# EAGLE design source_eagle (EAGLE 9.6.2)
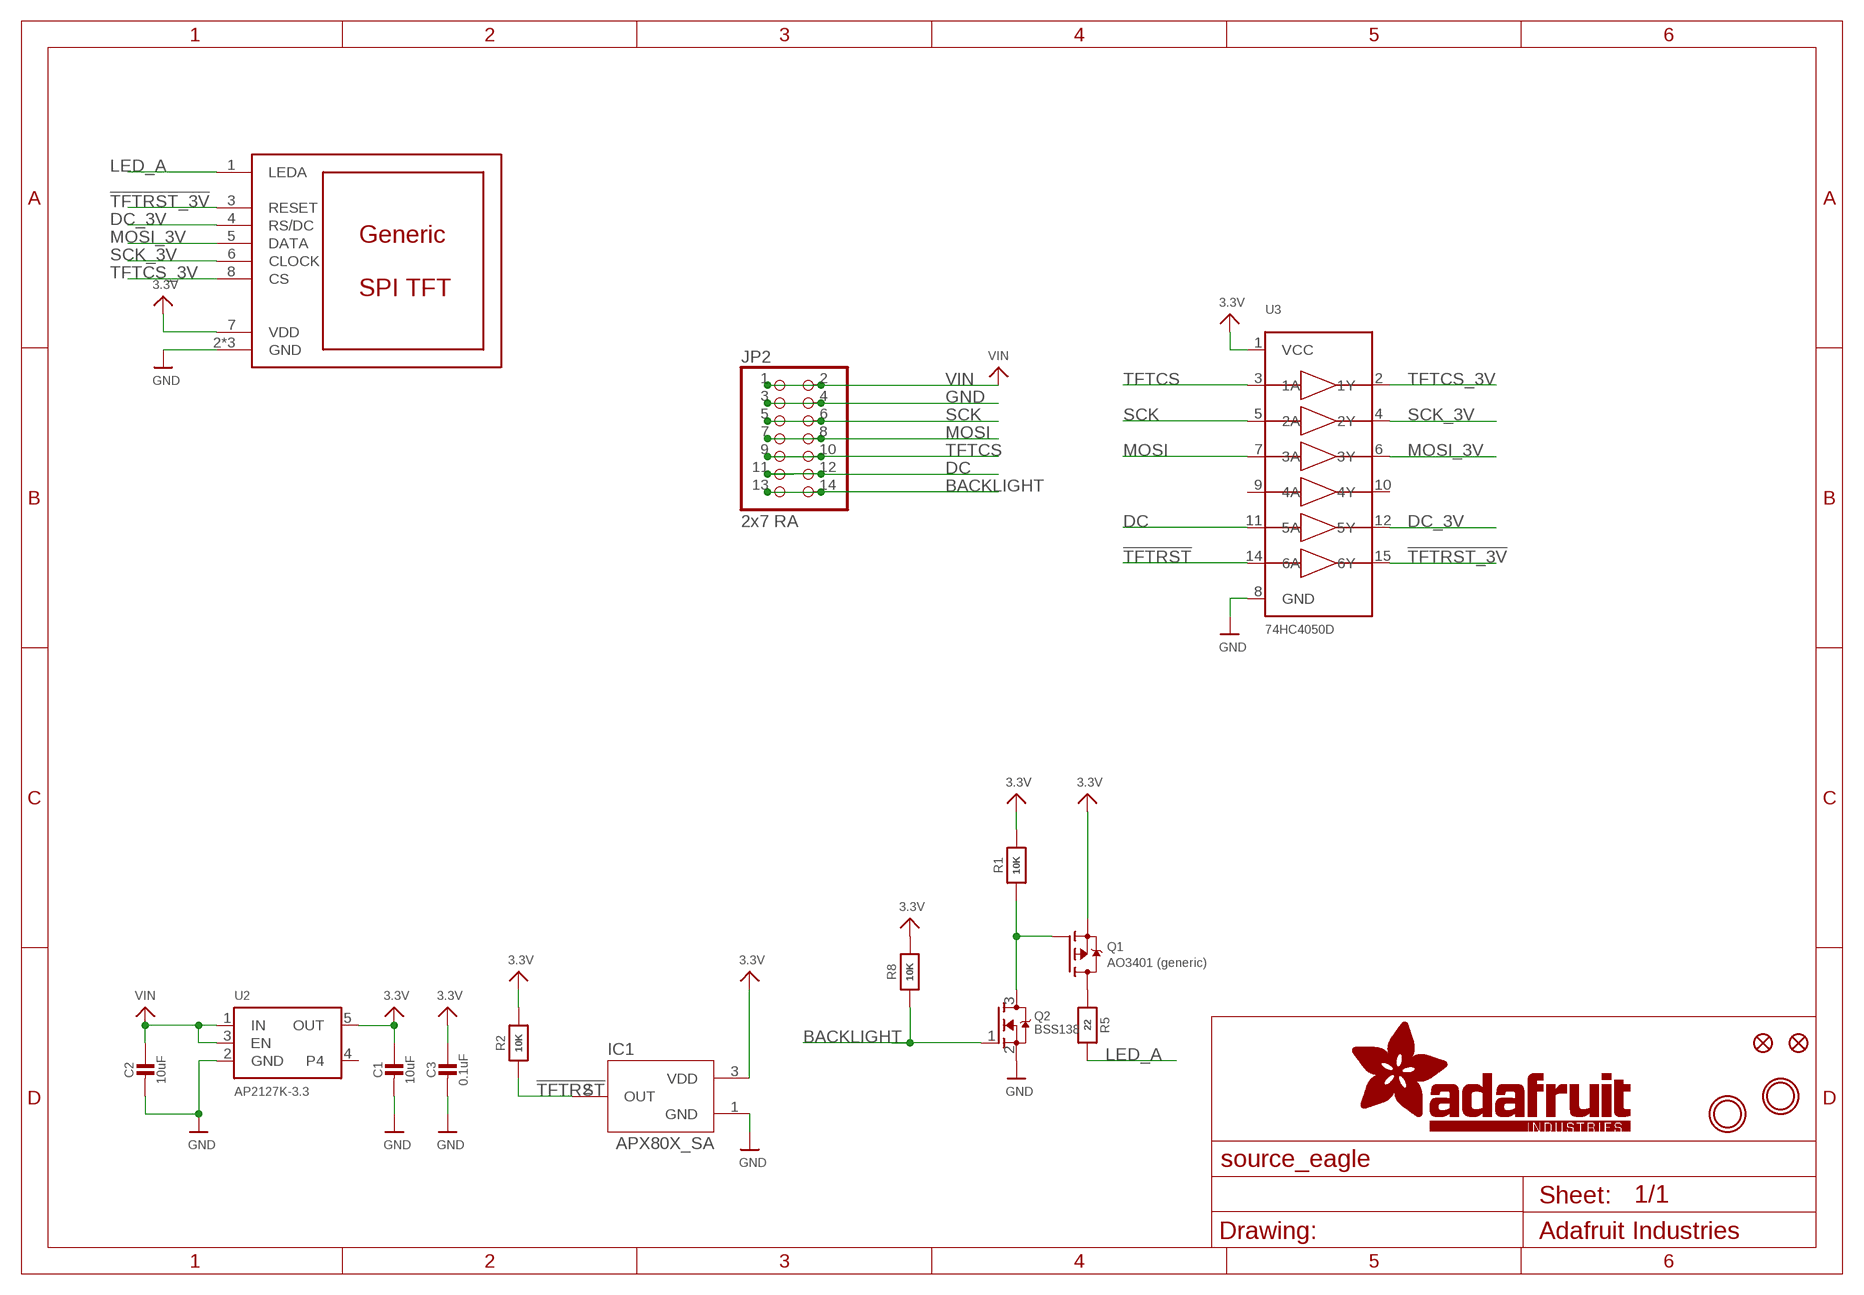
[diagram p0: schematic, sheet 1]

## Parts
C1  10uF  CAP_CERAMIC0805-NOOUTLINE  [0805-NO]
C2  10uF  CAP_CERAMIC0805-NOOUTLINE  [0805-NO]
C3  0.1uF  CAP_CERAMIC0603_NO  [0603-NO]
DISP2  DISP_LCD_GENERIC_SPI_NOLEDA_1.14_240X135_FPC  [TFT_1.14IN_240X135_FPC]
FID1  FIDUCIAL_1MM  [FIDUCIAL_1MM]
FID2  FIDUCIAL_1MM  [FIDUCIAL_1MM]
IC1  APX80X_SA  RESET_SUPERVISORAPX80X_SA  [SOT23-WIDE]
JP2  2x7 RA  HEADER-2X7_ROUND_70MIL  [2X07_ROUND_70MIL]
Q1  AO3401 (generic)  MOSFET-PWIDE  [SOT23-WIDE]
Q2  BSS138  MOSFET-NWIDE  [SOT23-WIDE]
R1  10K  RESISTOR_0603_NOOUT  [0603-NO]
R2  10K  RESISTOR_0603_NOOUT  [0603-NO]
R5  22  RESISTOR_0603_NOOUT  [0603-NO]
R8  10K  RESISTOR_0603_NOOUT  [0603-NO]
U2  AP2127K-3.3  VREG_SOT23-5  [SOT23-5]
U3  74HC4050D  74HC4050DTSSOP  [TSSOP16]
U$9  MOUNTINGHOLE2.5  [MOUNTINGHOLE_2.5_PLATED]
U$10  MOUNTINGHOLE2.5  [MOUNTINGHOLE_2.5_PLATED]

## Nets
3.3V: C1.1 C3.1 DISP2.7(VDD) IC1.3(VDD) Q1.2(S) R1.2 R2.2 R8.2 U2.5(OUT) U3.1(VCC)
!TFTRST: IC1.2(OUT) R2.1 U3.14(6A)
!TFTRST_3V: DISP2.3(RESET) U3.15(6Y)
BACKLIGHT: JP2.13 JP2.14 Q2.1(G) R8.1
DC: JP2.11 JP2.12 U3.11(5A)
DC_3V: DISP2.4(RS/DC) U3.12(5Y)
GND: C1.2 C2.2 C3.2 DISP2.2(GND) DISP2.MT1(GND) DISP2.MT2(GND) IC1.1(GND) JP2.3 JP2.4 Q2.2(S) U2.2(GND) U3.8(GND)
LED_A: DISP2.1(LEDA) R5.2
MOSI: JP2.7 JP2.8 U3.7(3A)
MOSI_3V: DISP2.5(DATA) U3.6(3Y)
N$1: Q1.3(D) R5.1
N$2: Q1.1(G) Q2.3(D) R1.1
SCK: JP2.5 JP2.6 U3.5(2A)
SCK_3V: DISP2.6(CLOCK) U3.4(2Y)
TFTCS: JP2.9 JP2.10 U3.3(1A)
TFTCS_3V: DISP2.8(CS) U3.2(1Y)
VIN: C2.1 JP2.1 JP2.2 U2.1(IN) U2.3(EN)
Unconnected: U2.4 U3.9(4A) U3.10(4Y)

## Library data of the parts
C1-C3 = microbuilder:CAP_CERAMIC: Ceramic Capacitors For new designs, use the packages preceded by an '_' character since they are more reliable: The following footprints should be used on most boards: _0402 - Standard footprint for regular board layouts _0603 - Standard footprint for regular board layouts _0805 - Standard footprint for regular board layouts _1206 - Standard footprint for regular board layouts For extremely tight-pitch boards where space is at a premium, the following 'micro-pitch' footprints can be used (smaller pads, no silkscreen outline, etc.): _0402MP - Micro-pitch footprint for very dense/compact boards _0603MP - Micro-pitch footprint for very dense/compact boards _0805MP - Micro-pitch footprint for very dense/compact boards _1206MP - Micro-pitch footprint for very dense/compact boards
DISP2 = adafruit_display:DISP_LCD_GENERIC_SPI_NOLEDA
FID1 FID2 = microbuilder:FIDUCIAL: Fiducial Alignment Points Various fiducial points for machine vision alignment.; BOM: EXCLUDE
IC1 = adafruit_power:RESET_SUPERVISOR; ROT: 270
JP2 = microbuilder:HEADER-2X7: PIN HEADER
Q1 = microbuilder:MOSFET-P: P-Channel Mosfet LEGEND VDS: Voltage Drain-Source ID: Drain Current RDS(ON): Drain-Source On-State Resistance VGS(TH): Gate-Source Threshold Voltage CISS: Drain-Source Input Capacitance SOT-23 Name VDS ID RDS(ON) VGS(TH) CISS Order Number IRLML5103 30V 760mA 600 mOhm -- 75pF @ 25V Digikey: IRLML5103PBFCT-ND IRLML6401 12V 4.3A 50 mOhm 950mV @ 250µA 830pF @ 10V Digikey: IRLML6401PBFTR-ND NTR0202PL 20V 400mA 800 mOhm 2.3V @ 250uA 70pF @ 5V Digikey: NTR0202PLT1GOSTR-ND NTR4101PT1G 20V 1.8A 85 mOhm 1.2V @ 250uA 675pF @ 10V Digikey: NTR4101PT1GOSCT-ND DMP2004K 20V 600mA 900 mOhm 1V @ 250uA 175pF @ 16V Digikey: DMP2004KDICT-ND PMV65XP 20V 3.9A 76 mOhm 950mV @ 1mA 725pF @ 20V Digikey: 568-2358-2-ND TO-252 Name VDS ID RDS(ON) VGS(TH) CISS Order Number AOD417 30V 25A 34 mOhm 3V @ 250µA 920pF @ 15V Digikey: 785-1106-2-ND PowerPak Name VDS ID RDS(ON) VGS(TH) CISS Order Number AON7401 30V 12A 14 mOhm 3V @ 250µA 2600pF @ 15V Digikey: 785-1302-1-ND
Q2 = microbuilder:MOSFET-N: N-Channel Mosfet LEGEND VDS: Voltage Drain-Source ID: Drain Current RDS(ON): Drain-Source On-State Resistance VGS(TH): Gate-Source Threshold Voltage CISS: Drain-Source Input Capacitance SOT-23 Name VDS ID RDS(ON) VGS(TH) CISS Order Number 2N7002E 60V 260mA 2.5 Ohm 2.5V @ 250uA 26.7pF @ 25V 2N7002ET1GOSTR-ND BSH103 30V 850mA 400 mOhm 400mV @ 1mA 83pF @ 24V BSH103,235-ND BSS138 60V 320mA 1.6 Ohm 1.5V @ 250uA 50pF @ 10V Mouser: 771-BSS138PW115 DMN2075U-7 20V 4.2A 38 mOhm 1V @ 250 uA 594.3pF @ 10V DMN2075U-7DICT-ND * BSS138 good choice for I2C level-shifting POWERPAK 1212-8 Name VDS ID RDS(ON) VGS(TH) CISS Order Number Si7308DN 60V 6A 58 mOhm 3V @ 250uA 665pF @ 15V SI7308DN-T1-E3CT-ND
R1 R2 R5 R8 = microbuilder:RESISTOR: Resistors For new designs, use the packages preceded by an '_' character since they are more reliable: The following footprints should be used on most boards: _0402 - Standard footprint for regular board layouts _0603 - Standard footprint for regular board layouts _0805 - Standard footprint for regular board layouts _1206 - Standard footprint for regular board layouts For extremely tight-pitch boards where space is at a premium, the following 'micro-pitch' footprints can be used (smaller pads, no silkscreen outline, etc.): _0402MP - Micro-pitch footprint for very dense/compact boards _0603MP - Micro-pitch footprint for very dense/compact boards _0805MP - Micro-pitch footprint for very dense/compact boards _1206MP - Micro-pitch footprint for very dense/compact boards
U2 = adafruit_power:VREG_SOT23-5: SOT23-5 Fixed Voltage Regulators Part Current Out V Out V In V Dropout θJA (°C/W) TJ (°C) Digikey Part No. ADP121 150mA 3.3V 3.4-5.5V 0.09V @ 150mA -- -- ADP121-AUJZ33R7CT-ND ADP121 150mA 3.0V 3.1-5.5V 0.09V @ 150mA -- -- ADP121-AUJZ30R7CT-ND ADP122 300mA 3.3V 3.4-5.5V 0.085V @ 300mA -- -- ADP122AUJZ-3.3-R7CT-ND ADP1712 300mA 3.3V 3.5-5.5V 0.17V @ 300mA -- -- ADP1712AUJZ-3.3-R7TR-ND AP7311 (Low Cost) 150mA 3.3V 3.5-6V 0.15V @ 150mA -- -- AP7311-33WG-7DICT-ND LD39015M18R 150mA 1.8V 1.9V-5.5V 0.08V @ 100mA -- -- 497-6977-1-ND LP2985A-33DBVR 150mA 3.3V 3.3-16V 0.28V @ 150mA 206 150 296-18479-1-ND MCP1824T-3302E/OT 300mA 3.3V 3.5V-6V 0.2V @ 300mA -- -- MCP1824T-3302E/OTCT-ND MIC5205-2.5YM5 TR 150mA 2.5V 2.7-16V 0.165V @ 150mA -- -- 576-1257-2-ND MIC5205-3.0YM5 TR 150mA 3.0V 3.2V-16V 0.165V @ 150mA -- -- 576-1258-2-ND MIC5205-3.3YM5 TR 150mA 3.3V 3.5V-16V 0.165V @ 150mA -- -- 576-1259-2-ND TPS780330220 150mA 3.3V+2.2V 3.6-5.5V 250mV Max -- -- 296-23332-1-ND TDA3663/N1,135 100mA 3.3V 3.5-45V 0.18V @ 50mA -- -- 568-5343-1-ND Max operating temp can be calculated using θJA, TJ (max junction temperature), and power in watts. Set the "Maximum Ambient Temperature" until it reaches TJ ("Max Junction Temperature"), which is the absolute limit for safe use of the regulator: Heat Sink Temperature Calculator <http://www.daycounter.com/Calculators/Heat-Sink-Temperature-Calculator.phtml> For example, With 12V source into a 3.3V LP2985 and a 30mA load, we are dissipating (12V-3.3V) * 0.03A = 0.261W. With a θJA of 206 °C/W, a TJ of 150°C, and 261mW we can safely use the chip without a heat sink up to 75°C (=147.1°C Junction Temperature).; JLC_ROTATION: 270
U3 = microbuilder:74HC4050D: 6-channel level shifter 74HC4050D - 2V-6V Supply SOIC16 Digikey: 74HC4050D,653-ND Mouser: 771-74HC4050D-T TSSOP16 Digikey: 296-9215-1-ND Mouser:
U$9 U$10 = adafruit_electromech:MOUNTINGHOLE: Mounting Hole For #2 screws (0.086"/2.18mm width, 0.094"/2.4mm hole) use 2.5mm; BOM: EXCLUDE

## Board
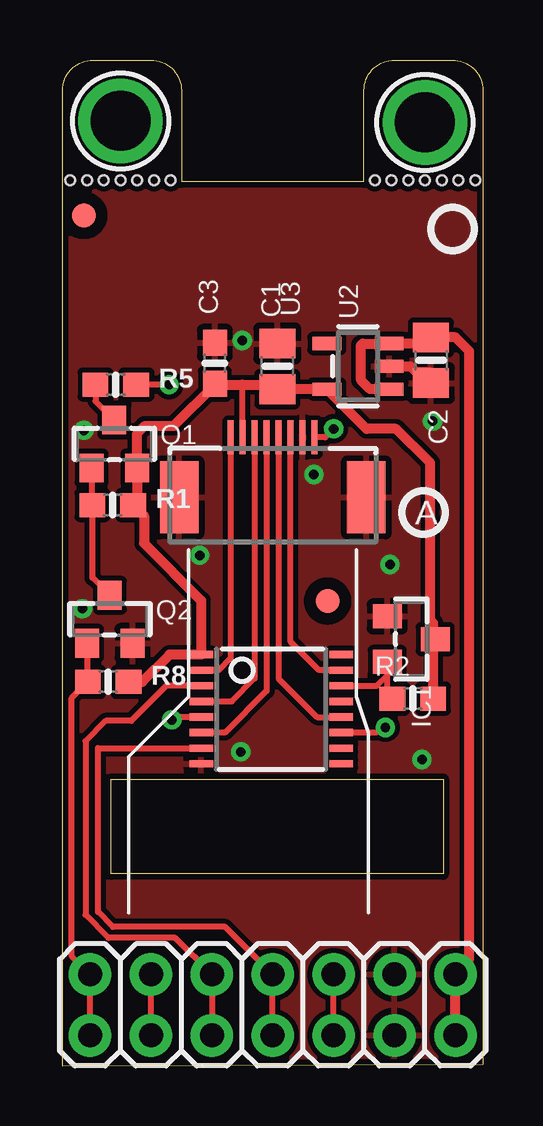
[diagram p1: board, top side]
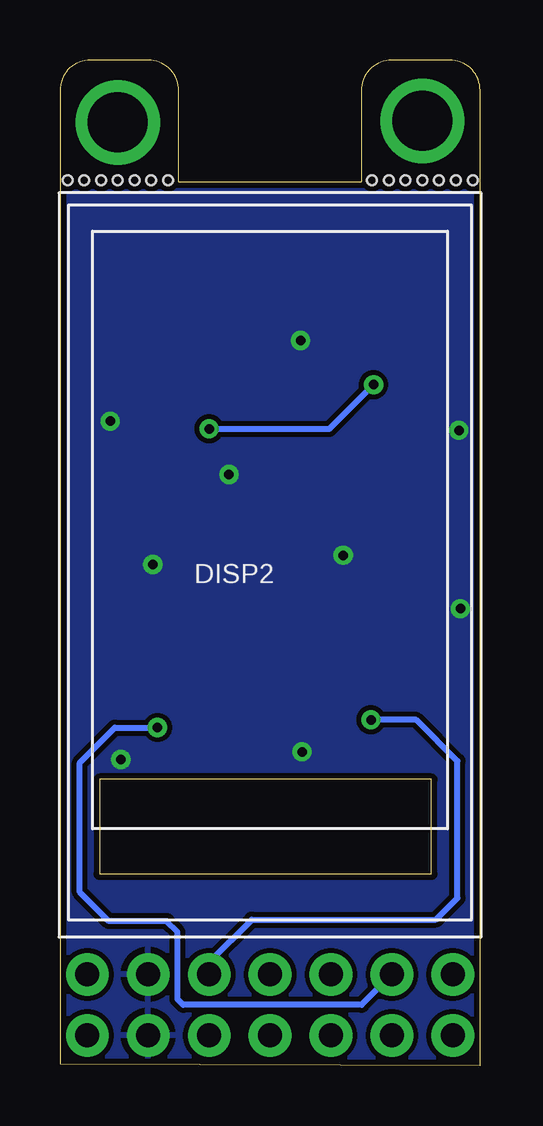
[diagram p2: board, bottom side, seen from below]

Size 17.53 x 41.91 mm. Coordinates in mm from the lower left corner, seen from the top.
Outline: 0,0 0,40.64 arc-90 1.27,41.91 3.68,41.91 arc-90 4.95,40.64 4.95,36.83 12.57,36.83 12.57,40.64 arc-90 13.84,41.91 16.26,41.91 arc-90 17.53,40.64 17.53,0.06 0,0
Outline: 15.87,11.94 15.87,8 2.03,8 2.03,11.94 15.87,11.94
Copper layers (1*16): Top 0.035mm / dielectric 1.5mm / Bottom 0.035mm
Design rules "adafruit *": minimum track width 8mil, minimum drill 15.5mil, track to track 8mil, track to pad 8mil, pad to pad 8mil, via to via 8mil, smd to smd 8mil, copper to edge 10mil, drill to drill 8mil, minimum pad ring 10mil, minimum via ring 8mil, stop-mask expansion 2mil, vias tented up to drill 20mil, thermal gap 10mil
Holes 0.4 mm at 0.32,36.89 1.02,36.89 1.71,36.89 2.41,36.89 3.11,36.89 3.81,36.89 4.51,36.89 13.02,36.89 13.72,36.89 14.41,36.89 15.11,36.89 15.81,36.89 16.51,36.89 17.21,36.89

### Footprints (pad centres in the part's own frame; a part is rotated, then mirrored left to right if it is on the bottom)
0805-NO = smd 1.24 x 1.5: 1 -0.95,0; 2 0.95,0
0603-NO = smd 1.075 x 1: 1 -0.85,0; 2 0.85,0
TFT_1.14IN_240X135_FPC = smd 0.25 x 1.4 bottom: 1 -1.75,1.172; 2 -1.25,1.172; 3 -0.75,1.172; 4 -0.25,1.172; 5 0.25,1.172; 6 0.75,1.172; 7 1.25,1.172; 8 1.75,1.172 | smd 1.6 x 3 bottom: MT1 -3.9,-1.338; MT2 3.9,-1.338
FIDUCIAL_1MM = smd 1 x 1: 1 0,0
SOT23-WIDE = smd 1 x 1.2: 1 -0.95,-1; 2 0.95,-1; 3 0,1
2X07_ROUND_70MIL = drill 1 pad 1.778: 1 -7.62,-1.27; 2 -7.62,1.27; 3 -5.08,-1.27; 4 -5.08,1.27; 5 -2.54,-1.27; 6 -2.54,1.27; 7 0,-1.27; 8 0,1.27; 9 2.54,-1.27; 10 2.54,1.27; 11 5.08,-1.27; 12 5.08,1.27; 13 7.62,-1.27; 14 7.62,1.27
SOT23-5 = smd 0.55 x 1.2: 1 -0.95,-1.3; 2 0,-1.3; 3 0.95,-1.3; 4 0.95,1.3; 5 -0.95,1.3
TSSOP16 = smd 0.305 x 0.991: 1 -2.275,-2.918; 2 -1.625,-2.918; 3 -0.975,-2.918; 4 -0.325,-2.918; 5 0.325,-2.918; 6 0.975,-2.918; 7 1.625,-2.918; 8 2.275,-2.918; 9 2.275,2.918; 10 1.625,2.918; 11 0.975,2.918; 12 0.325,2.918; 13 -0.325,2.918; 14 -0.975,2.918; 15 -1.625,2.918; 16 -2.275,2.918
MOUNTINGHOLE_2.5_PLATED = drill 2.5 pad 3.2: P$1 0,0

### Placement (x,y rotation side)
C1  8.95,29.15 90 top
C2  15.37,29.4 270 top
C3  6.35,29.27 90 top
DISP2  8.76,25.02 0 bottom
FID1  0.89,35.43 0 top
FID2  11.05,19.37 0 top
IC1  14.54,17.78 270 top
JP2  8.76,2.54 180 top
PLABEL0  [PLABEL0]  9.02,32.7 0 top
PLABEL1  [PLABEL1]  1.14,6.29 90 top
PLABEL2  [PLABEL2]  3.62,6.54 90 top
PLABEL3  [PLABEL3]  6.29,6.41 90 top
PLABEL4  [PLABEL4]  8.76,6.54 90 top
PLABEL5  [PLABEL5]  11.3,6.35 90 top
PLABEL6  [PLABEL6]  13.91,6.03 90 top
PLABEL7  [PLABEL7]  16.38,6.73 90 top
Q1  2.16,25.91 0 top
Q2  1.97,18.61 0 top
R1  2.1,23.37 0 top
R2  14.6,15.3 0 top
R5  2.22,28.38 0 top
R8  1.91,16 0 top
U2  12.32,29.15 90 top
U3  8.7,14.86 270 top
U$6  [PCBFEAT-REV-040]  16.26,34.86 0 top
U$9  2.41,39.37 0 top
U$10  15.11,39.31 0 top
U$15  [PCBFEAT-REV-040]  15.05,23.05 0 top

### Tracks (layer width: path | path; a pad name or v marks a point on that pad's centre or on a via)
3.3V
  Top 0.254: DISP2.7 7.51,28.36 7.49,28.38
  Top 0.406: R8.2 3.33,16 4.46,17.13 U3.1 5.78,19.39 3.39,21.78 3.39,22.92 R1.2 3.11,23.53 Q1.2 3.11,26.35 3.43,26.67 4.64,26.67 6.35,28.38 | 6.35,28.38 7.49,28.38 8.77,28.38 C1.1 U2.5 12.67,26.54 13.91,26.54 15.33,25.12 15.33,18.33 15.46,18.46 15.46,17.69 | R2.2 15.46,17.69 | 15.46,17.69 IC1.3 | C3.1 6.35,28.38
!TFTRST
  Top 0.254: U3.14 13.1,15.83 13.54,16.28 IC1.2 13.54,15.52 R2.1
!TFTRST_3V
  Top 0.254: U3.15 10.69,16.48 9.51,17.66 DISP2.3
BACKLIGHT
  Top 0.254: Q2.1 1.05,17.57 R8.1 0.38,15.33 0.38,4.57 JP2.13 JP2.14
DC  (via drill 0.39)
  Top 0.254: JP2.12 JP2.11 | U3.11 13.08,13.88 13.29,14.1 v13.46,14.1
  Bottom 0.254: JP2.11 4.95,2.54 12.38,2.54 12.62,2.78 12.62,5.58 13.07,6.03 15.49,6.03 16.7,7.24 16.7,12.64 15.24,14.1 v13.46,14.1
DC_3V
  Top 0.254: DISP2.4 9.01,16.13 10.61,14.53 U3.12
GND  (via drill 0.39)
  Top 0.406: U2.2 14.51,29.15 14.76,28.89 15.37,28.89 C2.2
  other vias: 10.48,24.64 7.49,30.23 15.43,26.86 13.65,20.89 5.71,21.27 0.83,19.05 0.89,26.48 7.43,13.08 14.99,12.76
  pour Top: -0.13,0 -0.13,36.83 17.65,36.83 17.65,0
  pour Bottom: -0.13,0 -0.13,36.83 17.65,36.83 17.65,0
LED_A  (via drill 0.39)
  Top 0.254: v11.3,26.54 10.95,26.19 DISP2.1 | v4.45,28.38 R5.2
  Bottom 0.254: v11.3,26.54 6.29,26.54 v4.45,28.38
MOSI
  Top 0.254: JP2.8 JP2.7 6.78,5.79 2.09,5.79 1.47,6.41 1.47,13.23 U3.7
MOSI_3V
  Top 0.254: DISP2.5 8.51,15.62 6.77,13.88 U3.6
N$1
  Top 0.254: R5.1 1.37,27.7 Q1.3
N$2
  Top 0.254: Q1.1 1.21,23.4 R1.1 1.25,20.33 Q2.3
SCK  (via drill 0.39)
  Top 0.254: JP2.6 JP2.5 | U3.5 4.68,14.53 v4.56,14.41
  Bottom 0.254: JP2.5 11.3,4.32 9.52,6.1 1.84,6.1 0.95,6.99 0.95,12.7 2.67,14.41 v4.56,14.41
SCK_3V
  Top 0.254: DISP2.6 8.01,16.14 7.05,15.18 U3.4
TFTCS
  Top 0.254: JP2.10 JP2.9 4.7,5.33 1.91,5.33 0.95,6.29 0.95,13.53 1.79,14.37 2.86,14.37 4.32,15.83 U3.3
TFTCS_3V
  Top 0.254: DISP2.8 7.01,16.98 6.51,16.48 U3.2
VIN
  Top 0.406: U2.1 12.82,28.2 12.45,28.57 12.45,30.04 12.51,30.1 U2.3 15.11,30.1 C2.1 16.39,30.35 16.95,29.78 16.95,4.45 16.38,3.87 JP2.1 JP2.2

### Text on the board
Pinguin_tBackup: NEWXIE / ST7789 TFT / 1.14" 240x135 | BL | DC | CS | DA | CL | G | V+